# EasyEDA schematic SCH_RE2-YM2612-3438-v0.8_2024-09-22.json

## Sheets
1 MegaMod: TITLE: Sheet_1; REV: 1.0; Date: 2023-11-14; Sheet: 1/1; Drawn By: Denjhang; Company: Your Company
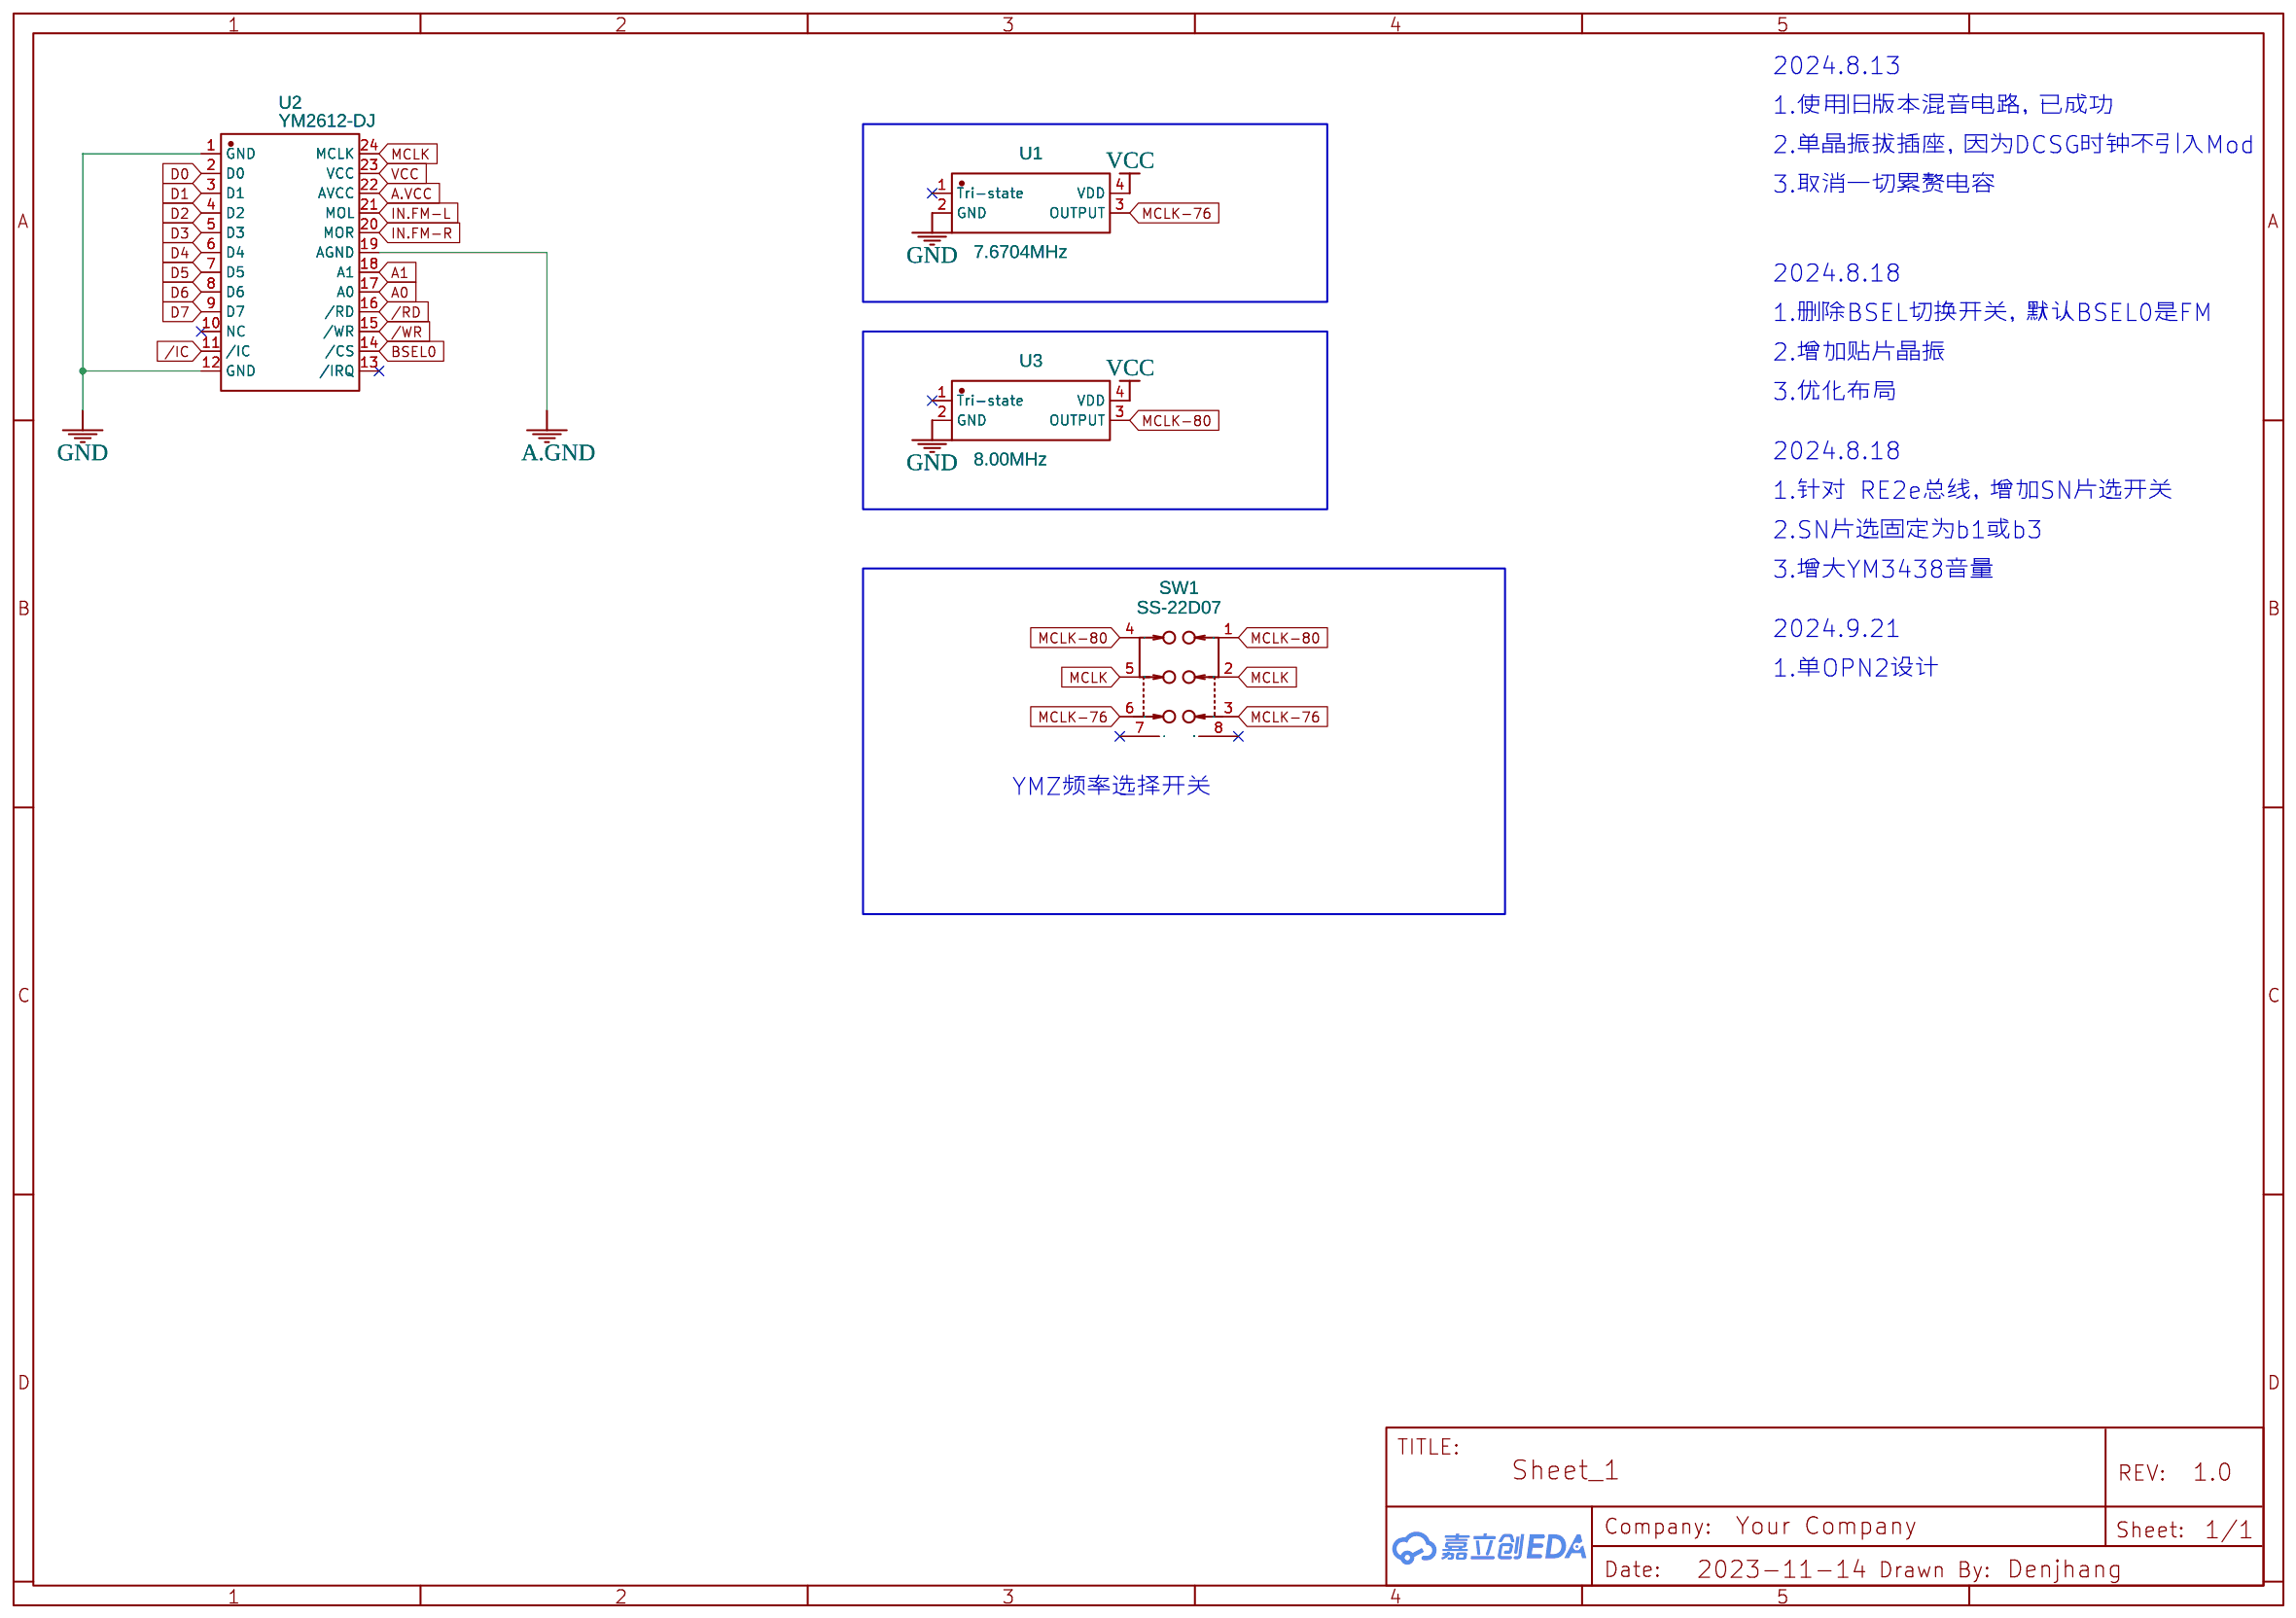
[diagram p0: MegaMod]
2 Mixer
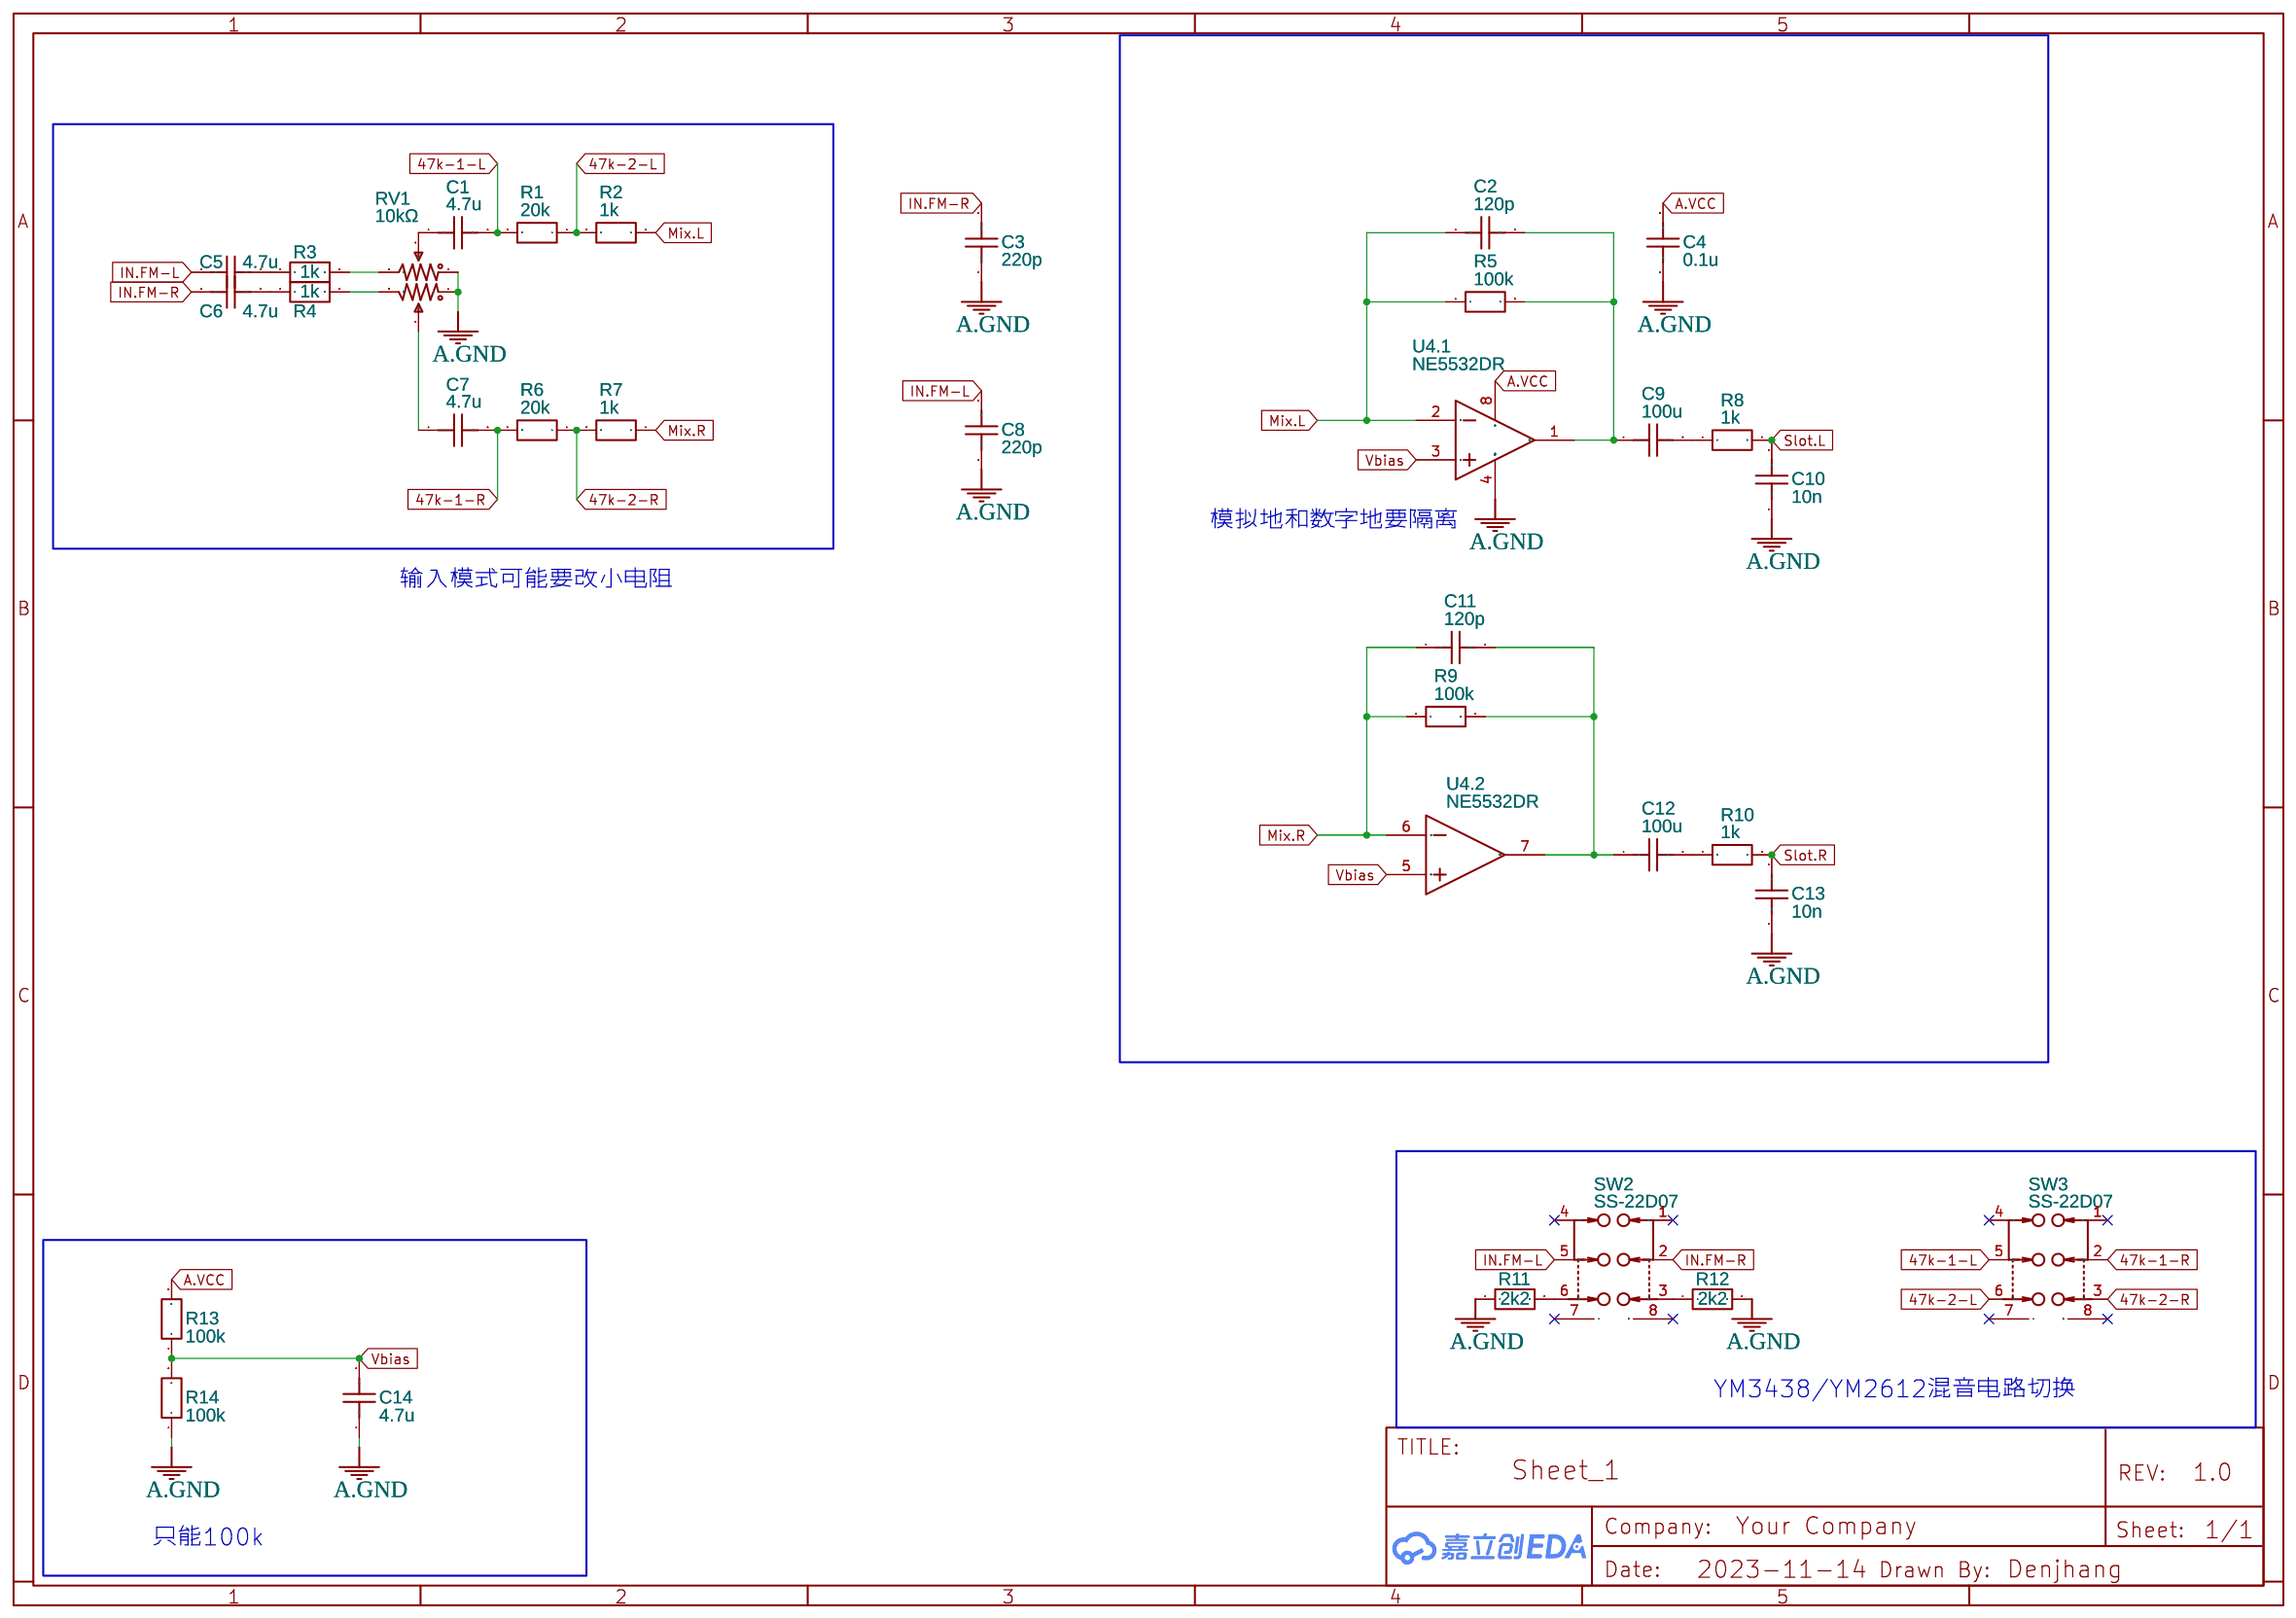
[diagram p1: Mixer]
3 RE-Birth
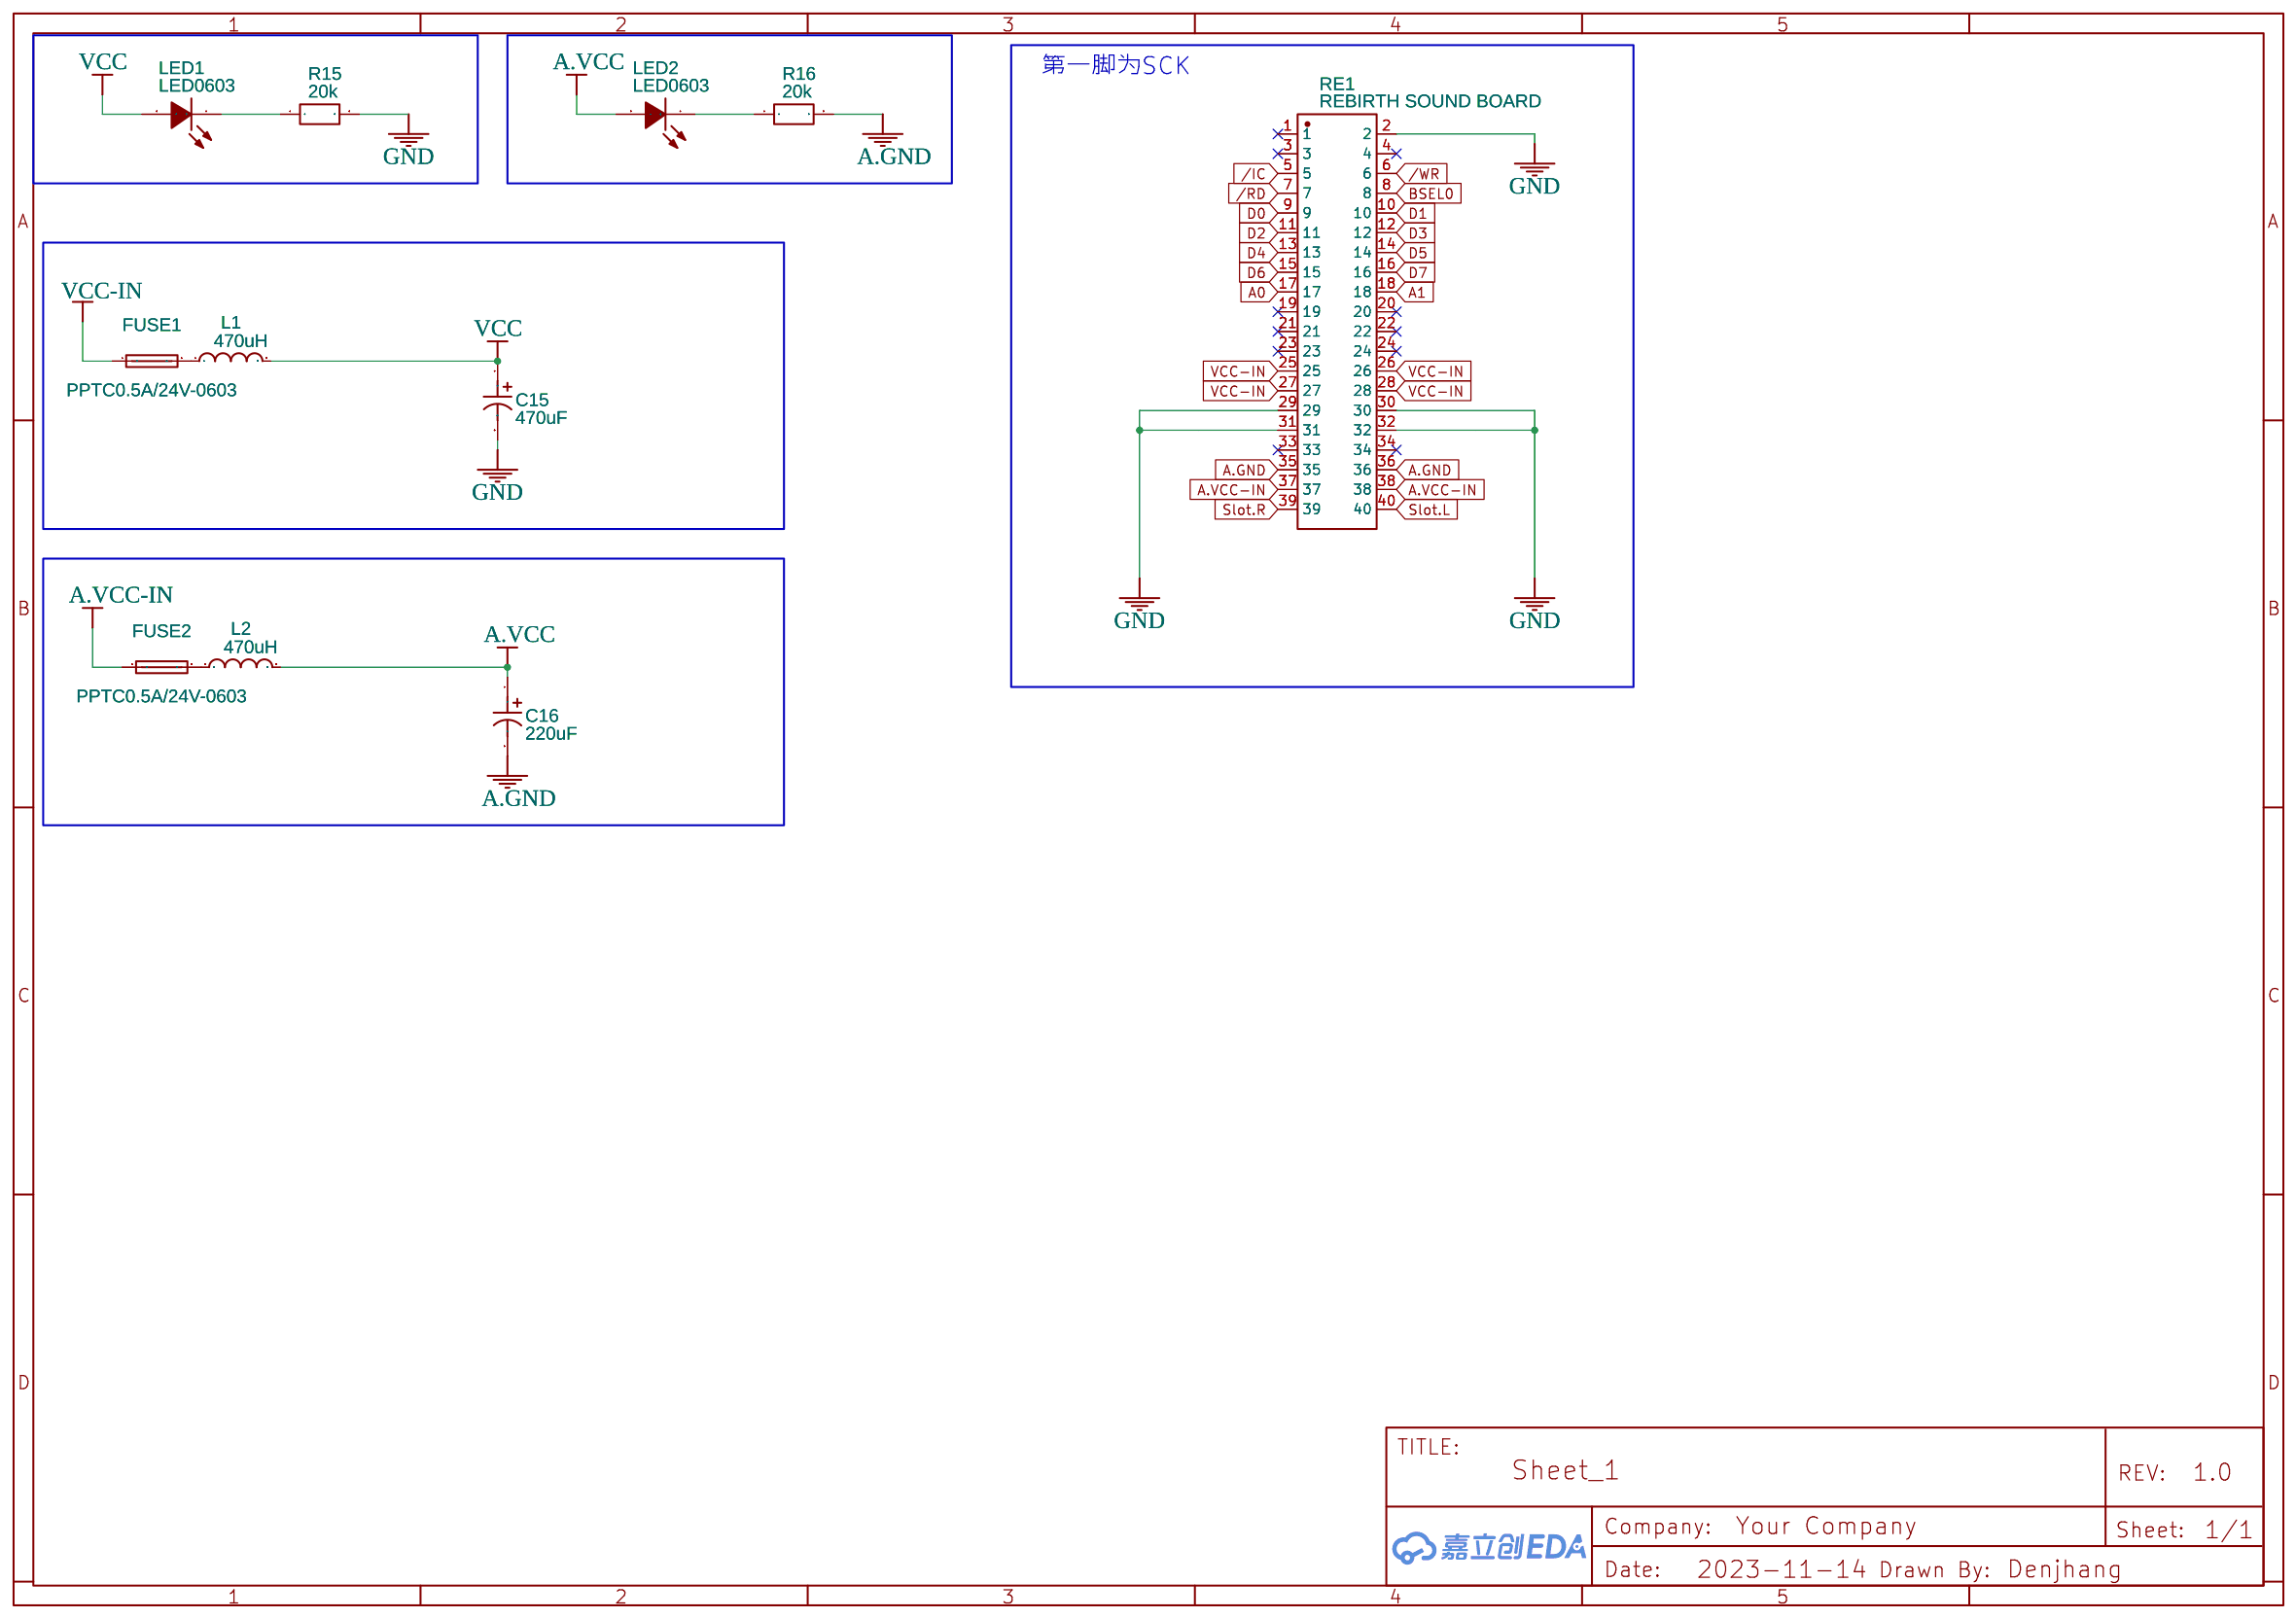
[diagram p2: RE-Birth]

## Parts
sheet MegaMod
SW1  SS-22D07  [SW-TH_SS-22D07]
U1  7.6704MHz  [OSC-SMD_4P-L3.2-W2.5-BL]
U2  YM2612-DJ  [DIP-24_L31.0-W13.5-P2.54-LS15.2-BL]
U3  8.00MHz  [OSC-SMD_4P-L3.2-W2.5-BL]
sheet Mixer
C1  4.7u  [C0603]
C2  120p  [C0603]
C3  220p  [C0603]
C4  0.1u  [C0603]
C5  4.7u  [C0603]
C6  4.7u  [C0603]
C7  4.7u  [C0603]
C8  220p  [C0603]
C9  100u  [C1206]
C10  10n  [C0603]
C11  120p  [C0603]
C12  100u  [C1206]
C13  10n  [C0603]
C14  4.7u  [C0603]
R1  20k  [R0603]
R2  1k  [R0603]
R3  1k  [R0603]
R4  1k  [R0603]
R5  100k  [R0603]
R6  20k  [R0603]
R7  1k  [R0603]
R8  1k  [R0603]
R9  100k  [R0603]
R10  1k  [R0603]
R11  2k2  [R0603]
R12  2k2  [R0603]
R13  100k  [R0603]
R14  100k  [R0603]
RV1  10kΩ  [RK097G-DJ]
SW2  SS-22D07  [SW-TH_SS-22D07]
SW3  SS-22D07  [SW-TH_SS-22D07]
U4  NE5532DR  [SOIC-8_L4.9-W3.9-P1.27-LS6.0-BL]  (sections 1,2)
sheet RE-Birth
C15  470uF  [CAP-SMD_BD6.3-L6.6-W6.6-FD]
C16  220uF  [CAP-SMD_BD6.3-L6.6-W6.6-LS7.2-FD]
FUSE1  PPTC0.5A/24V-0603  [F0603]
FUSE2  PPTC0.5A/24V-0603  [F0603]
L1  470uH  [IND-SMD_L5.8-W5.2]
L2  470uH  [IND-SMD_L5.8-W5.2]
LED1  LED0603  [LED0603-RD]
LED2  LED0603  [LED0603-RD]
R15  20k  [R0603]
R16  20k  [R0603]
RE1  REBIRTH SOUND BOARD  [REBIRTH SOUND BOARD]

## Library data of the parts
SW1-SW3 = SS-22D07: Supplier Part: C34982; Supplier: LCSC; Manufacturer: ReliaPro; JLCPCB Part Class: Extended Part; link: https://so.szlcsc.com/global.html?k=C34982&ref=editor
U1 U3 = OT32254MJBA4SL: Contributor: lcsc; Supplier: LCSC; Supplier Part: C2831397; Manufacturer: YXC(扬兴晶振); JLCPCB Part Class: Extended Part; link: https://so.szlcsc.com/global.html?k=C2831397&ref=editor
U2 = YM2612-DJ: Supplier Part: C707077; Manufacturer: YAMAHA; Manufacturer Part: YM2612; Contributor: Denjhang; JLCPCB SMD: Yes; SMT Type: Extend
C1-C8 C10 C11 C13 C14 = C_0603_US: Contributor: LCEDA_Lib
C9 C12 = C_1206_US: Contributor: LCEDA_Lib
R1-R16 = R_0603_EU: Contributor: LCEDA_Lib
RV1 = RK097-双连体: Contributor: LCSC; Supplier: LCSC; Supplier Part: C231763; Manufacturer: ALPSALPINE(阿尔卑斯阿尔派); Manufacturer Part: RK09712200MY; JLCPCB Part Class: Extended Part
U4 = NE5532DR: image: //image.lceda.cn/szlcsc/C7426.jpg; SMT Type: Basic; subpart_no: 2; Supplier: LCSC; Manufacturer: TI(德州仪器); LCSC Assembly: Yes; Supplier Part: C7426; JLCPCB Part Class: Basic Part; link: https://so.szlcsc.com/global.html?k=C7426&ref=editor
C15 = RVT220UF16V67RV0015: Contributor: LCSC; Supplier: LCSC; Supplier Part: C2887273; Manufacturer: KNSCHA(科尼盛); JLCPCB Part Class: Extended Part; link: https://so.szlcsc.com/global.html?k=C2887273&ref=editor
C16 = RVT47UF35V67RV0039: Contributor: LCSC; Supplier: LCSC; Supplier Part: C2836440; Manufacturer: KNSCHA(科尼盛); JLCPCB Part Class: Extended Part; link: https://so.szlcsc.com/global.html?k=C2836440&ref=editor
FUSE1 FUSE2 = PPTC0.5A/24V-0603: Contributor: LCSC; Supplier: LCSC; Supplier Part: C9900007586; Manufacturer: null; Manufacturer Part: PPTC0.5A/24V 自恢复保险丝-0603; JLCPCB Part Class: Extended Part
L1 L2 = MSCD54-471KT: Contributor: LCSC; Supplier: LCSC; Supplier Part: C915206; Manufacturer: Meled(美莱); JLCPCB Part Class: Extended Part; link: https://so.szlcsc.com/global.html?k=C915206&ref=editor
LED1 LED2 = LED0603: Supplier: LCSC; Supplier Part: C2892154; Manufacturer: GBG; Manufacturer Part: GBG-C192KRKT; link: https://atta.szlcsc.comnull; Contributor: Denjhang
RE1 = REBIRTH SOUND BOARD: Contributor: lcsc; Supplier: LCSC; Supplier Part: C5242133; Manufacturer: XKB Connectivity(中国星坤); Manufacturer Part: X6522WR-2x20H-C60D30-E43F03

## Nets
GND: C15.2 R15.2 RE1.2 RE1.29 RE1.30 RE1.31 RE1.32 U1.2(GND) U2.1(GND) U2.12(GND) U3.2(GND)
VCC: C15.1 L1.2 LED1.2(A) U1.4(VDD) U2.23(VCC) U3.4(VDD)
VCC-IN: FUSE1.1 RE1.25 RE1.26 RE1.27 RE1.28
47k-1-L: C1.2 R1.2 SW3.5
47k-1-R: C7.2 R6.2 SW3.2
47k-2-L: R1.1 R2.2 SW3.6
47k-2-R: R6.1 R7.2 SW3.3
/IC: RE1.5 U2.11(/IC)
/RD: RE1.7 U2.16(/RD)
/WR: RE1.6 U2.15(/WR)
A0: RE1.17 U2.17(A0)
A1: RE1.18 U2.18(A1)
A.GND: C3.1 C4.1 C8.1 C10.1 C13.1 C14.1 C16.2 R11.1 R12.2 R14.1 R16.2 RE1.35 RE1.36 RV1.1 RV1.4 U2.19(AGND) U4.4(VCC-/GND)
A.VCC: C4.2 C16.1 L2.2 LED2.2(A) R13.2 U2.22(AVCC) U4.8(VCC+)
A.VCC-IN: FUSE2.1 RE1.37 RE1.38
BSEL0: RE1.8 U2.14(/CS)
D0: RE1.9 U2.2(D0)
D1: RE1.10 U2.3(D1)
D2: RE1.11 U2.4(D2)
D3: RE1.12 U2.5(D3)
D4: RE1.13 U2.6(D4)
D5: RE1.14 U2.7(D5)
D6: RE1.15 U2.8(D6)
D7: RE1.16 U2.9(D7)
IN.FM-L: C5.1 C8.2 SW2.5 U2.21(MOL)
IN.FM-R: C3.2 C6.1 SW2.2 U2.20(MOR)
MCLK: SW1.2 SW1.5 U2.24(MCLK)
MCLK-76: SW1.3 SW1.6 U1.3(OUTPUT)
MCLK-80: SW1.1 SW1.4 U3.3(OUTPUT)
Mix.L: C2.1 R2.1 R5.1 U4.2(IN1-)
Mix.R: C11.1 R7.1 R9.1 U4.6(IN2-)
Slot.L: C10.2 R8.2 RE1.40
Slot.R: C13.2 R10.2 RE1.39
Vbias: C14.2 R13.1 R14.2 U4.3(IN1+) U4.5(IN2+)
Net-(C1-1): C1.1 RV1.2
Net-(C2-2): C2.2 C9.1 R5.2 U4.1(OUT1)
Net-(C5-2): C5.2 R3.1
Net-(C6-2): C6.2 R4.1
Net-(C7-1): C7.1 RV1.5
Net-(C9-2): C9.2 R8.1
Net-(C11-2): C11.2 C12.1 R9.2 U4.7(OUT2)
Net-(C12-2): C12.2 R10.1
Net-(FUSE1-2): FUSE1.2 L1.1
Net-(FUSE2-2): FUSE2.2 L2.1
Net-(LED1-1): LED1.1(C) R15.1
Net-(LED2-1): LED2.1(C) R16.1
Net-(R3-2): R3.2 RV1.3
Net-(R4-2): R4.2 RV1.6
Net-(R11-2): R11.2 SW2.6
Net-(R12-1): R12.1 SW2.3

Not connected (* = marked no-connect by the designer): RE1 1* 3* 4* 19* 20* 21* 22* 23* 24* 33* 34*; SW1 7* 8*; SW2 1* 4* 7* 8*; SW3 1* 4* 7* 8*; U1 1(Tri-state)*; U2 10(NC)* 13(/IRQ)*; U3 1(Tri-state)*

## Notes on the sheets
sheet 1
- 2024.8.13
- 1.使用旧版本混音电路，已成功
- 2.单晶振拔插座，因为DCSG时钟不引入Mod
- 3.取消一切累赘电容
- 2024.8.18
- 1.删除BSEL切换开关，默认BSEL0是FM
- 2.增加贴片晶振
- 3.优化布局
- 2024.8.18
- 1.针对 RE2e总线，增加SN片选开关
- 2.SN片选固定为b1或b3
- 3.增大YM3438音量
- 2024.9.21
- 1.单OPN2设计
- YMZ频率选择开关
sheet 2
- 模拟地和数字地要隔离
- 输入模式可能要改小电阻
- YM3438/YM2612混音电路切换
- 只能100k
sheet 3
- 第一脚为SCK
